# EAGLE schematic Platine_L6470 (EAGLE 6.2)
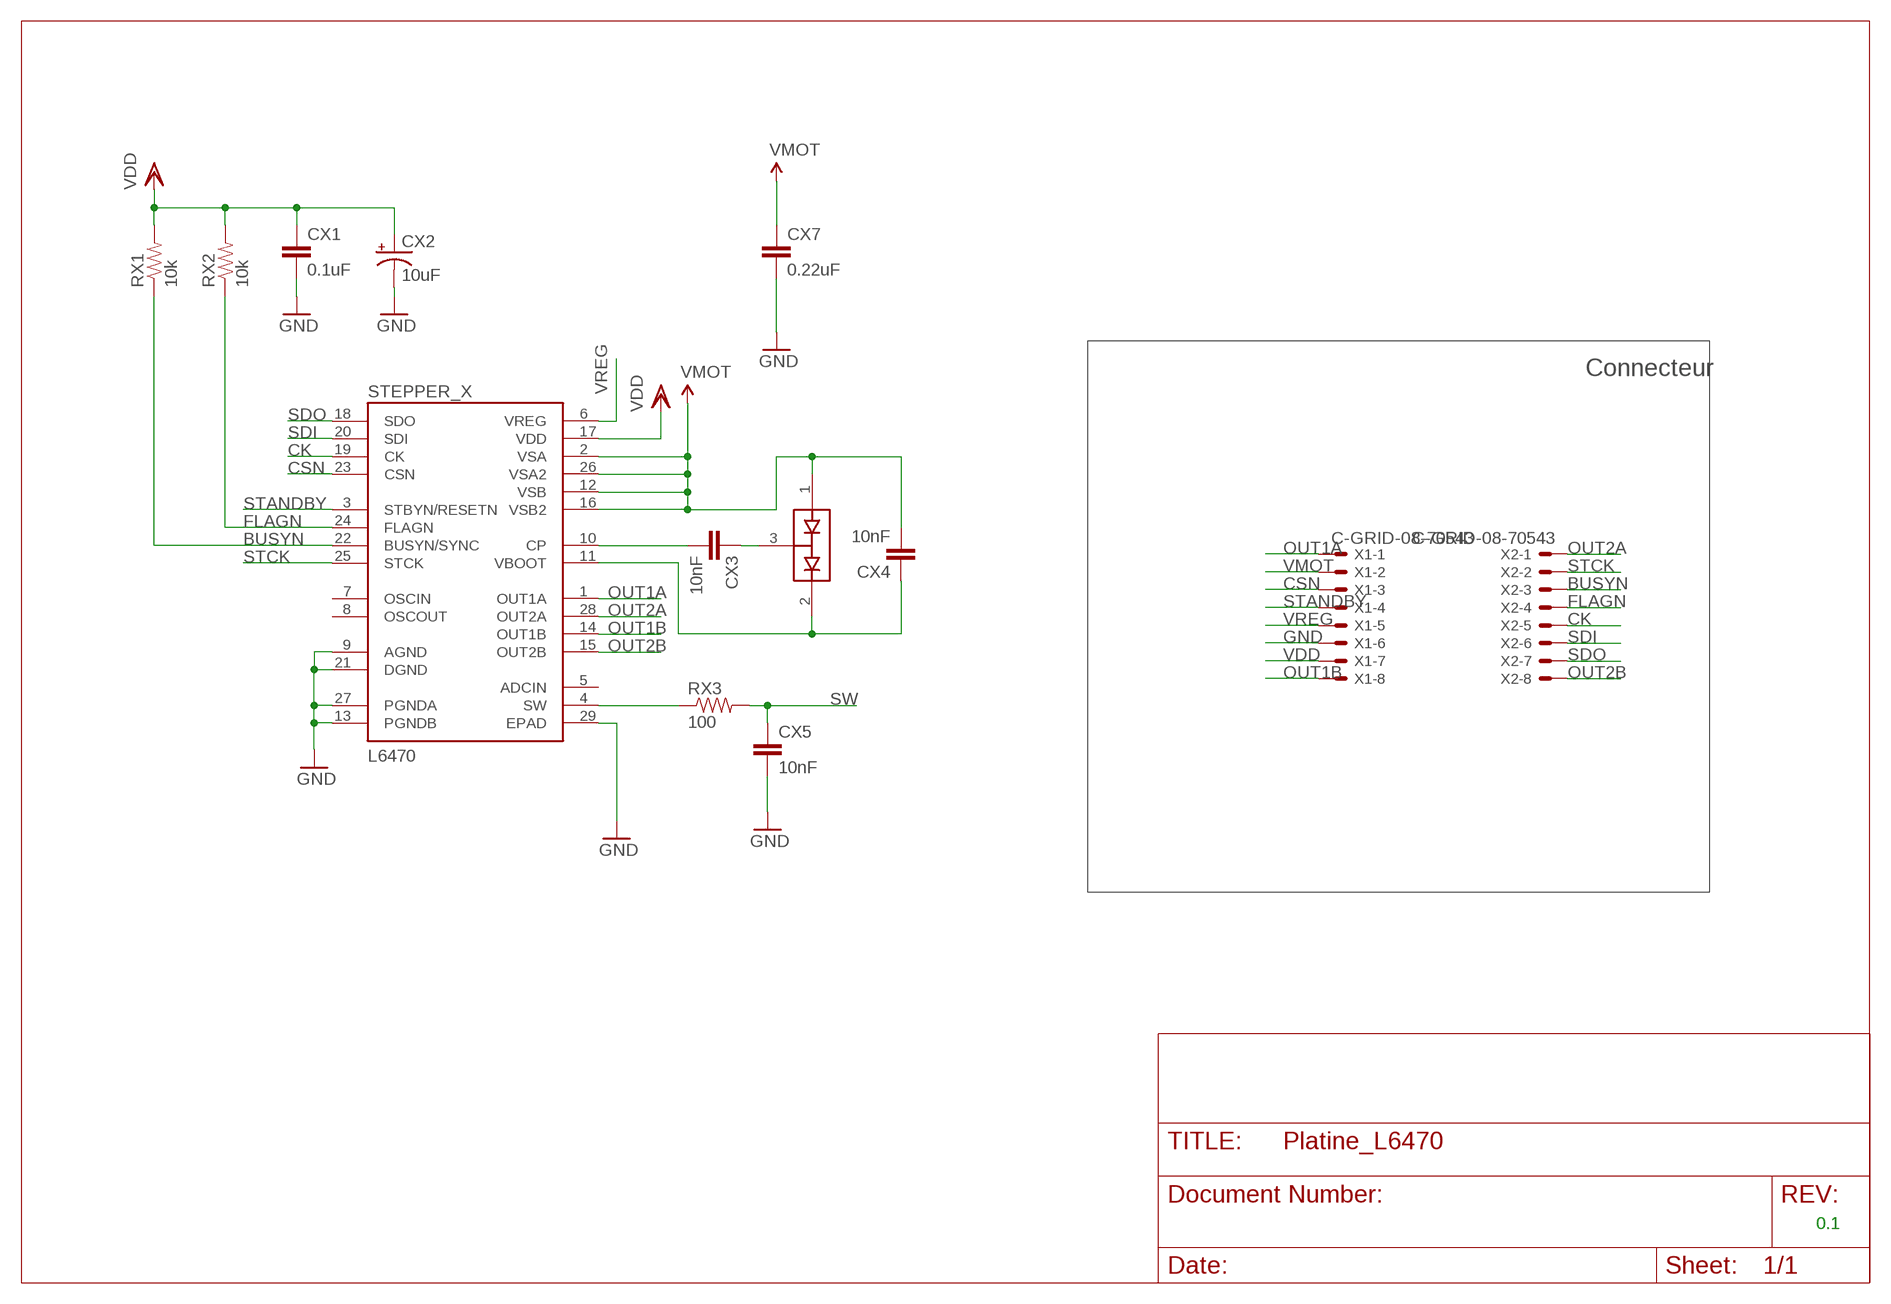
[diagram p0: schematic, sheet 1]

## Parts
CX1  0.1uF  CAP0402-CAP  [0402-CAP]
CX2  10uF  CAP_POL1206  [EIA3216]
CX3  10nF  CAP0402-CAP  [0402-CAP]
CX4  10nF  CAP0402-CAP  [0402-CAP]
CX5  10nF  CAP0402-CAP  [0402-CAP]
CX7  0.22uF  CAP0603-CAP  [0603-CAP]
DX1  BAV99  [SOT23]
RX1  10k  RESISTOR0402-RES  [0402-RES]
RX2  10k  RESISTOR0402-RES  [0402-RES]
RX3  100  RESISTOR0402-RES  [0402-RES]
STEPPER_X  L6470  L6470  [HTSSOP28]
X1  C-GRID-08-70543  [70543-08]
X2  C-GRID-08-70543  [70543-08]

## Nets
BUSYN: RX1.1 STEPPER_X.22(BUSYN/SYNC) X2.3
CK: STEPPER_X.19(CK) X2.5
CSN: STEPPER_X.23(CSN) X1.3
FLAGN: RX2.1 STEPPER_X.24(FLAGN) X2.4
GND: CX1.2 CX2.C(-) CX5.2 CX7.2 STEPPER_X.9(AGND) STEPPER_X.13(PGNDB) STEPPER_X.21(DGND) STEPPER_X.27(PGNDA) STEPPER_X.29(EPAD) X1.6
N$6: CX3.2 STEPPER_X.10(CP)
N$8: CX3.1 DX1.3(COM)
N$9: CX4.1 DX1.2(C2) STEPPER_X.11(VBOOT)
N$10: RX3.1 STEPPER_X.4(SW)
OUT1A: STEPPER_X.1(OUT1A) X1.1
OUT1B: STEPPER_X.14(OUT1B) X1.8
OUT2A: STEPPER_X.28(OUT2A) X2.1
OUT2B: STEPPER_X.15(OUT2B) X2.8
SDI: STEPPER_X.20(SDI) X2.6
SDO: STEPPER_X.18(SDO) X2.7
STANDBY: STEPPER_X.3(STBYN/RESETN) X1.4
STCK: STEPPER_X.25(STCK) X2.2
SW: CX5.1 RX3.2
VDD: CX1.1 CX2.A(+) RX1.2 RX2.2 STEPPER_X.17(VDD) X1.7
VMOT: CX4.2 CX7.1 DX1.1(A1) STEPPER_X.2(VSA) STEPPER_X.12(VSB) STEPPER_X.16(VSB2) STEPPER_X.26(VSA2) X1.2
VREG: STEPPER_X.6(VREG) X1.5
Unconnected: STEPPER_X.5(ADCIN) STEPPER_X.7(OSCIN) STEPPER_X.8(OSCOUT)

## Notes on the sheet
- Connecteur
- 0.1

## Library data of the parts
CX1 CX3-CX5 CX7 = SparkFun:CAP: Capacitor Standard 0603 ceramic capacitor, and 0.1" leaded capacitor.
CX2 = SparkFun:CAP_POL: Capacitor Polarized These are standard SMD and PTH capacitors. Normally 10uF, 47uF, and 100uF in electrolytic and tantalum varieties. Always verify the external diameter of the through hole cap, it varies with capacity, voltage, and manufacturer. The EIA devices should be standard.
DX1 = miscellany:BAV99: BAV99 Two small signal silicon diodes connected anode to cathode. Connections to all three nodes available.
RX1-RX3 = SparkFun:RESISTOR: Resistor Basic schematic elements and footprints for 0603, 1206, and PTH resistors.
STEPPER_X = miscellany:L6470: L6470 3A RMS/7A peak bipolar stepper motor driver with SPI control and step input in HTSSOP-28 package.
X1 X2 = con-molex:C-GRID-08: CONNECTOR wire to board 2.54 mm (0.100") pitch header; OC_FARNELL: unknown; OC_NEWARK: unknown